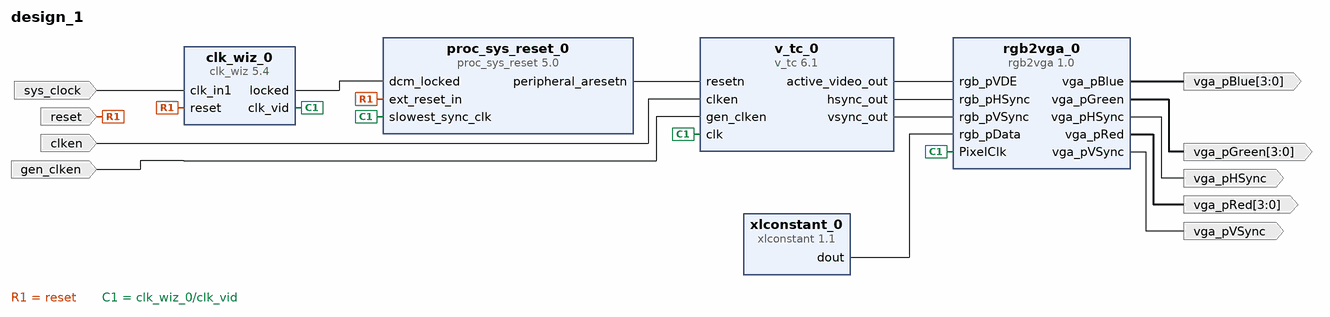
[diagram p0: block diagram of the top level]
# Vivado block design design_1, xc7a35tcpg236-1, Vivado 2017.4
create_bd_design design_1

create_bd_port -dir I -type clk sys_clock
set_property -dict {CONFIG.FREQ_HZ 100000000 CONFIG.PHASE 0.000} [get_bd_ports sys_clock]
create_bd_port -dir I -type rst reset
set_property -dict {CONFIG.POLARITY ACTIVE_HIGH} [get_bd_ports reset]
create_bd_port -dir O -from 3 -to 0 vga_pRed
create_bd_port -dir O -from 3 -to 0 vga_pGreen
create_bd_port -dir O -from 3 -to 0 vga_pBlue
create_bd_port -dir O vga_pHSync
create_bd_port -dir O vga_pVSync
create_bd_port -dir I -type ce clken
create_bd_port -dir I gen_clken

create_bd_cell -type ip -vlnv xilinx.com:ip:clk_wiz:5.4 clk_wiz_0
set_property -dict [list \
  CONFIG.CLKOUT2_USED true \
  CONFIG.NUM_OUT_CLKS 2 \
  CONFIG.CLK_OUT1_PORT clk_ap \
  CONFIG.CLK_OUT2_PORT clk_vid \
  CONFIG.CLKOUT1_REQUESTED_OUT_FREQ 450.000 \
  CONFIG.CLKOUT2_REQUESTED_OUT_FREQ 25.000 \
  CONFIG.MMCM_DIVCLK_DIVIDE 1 \
  CONFIG.MMCM_CLKFBOUT_MULT_F 9.000 \
  CONFIG.MMCM_CLKOUT0_DIVIDE_F 2.000 \
  CONFIG.MMCM_CLKOUT1_DIVIDE 36 \
  CONFIG.USE_BOARD_FLOW true \
  CONFIG.CLK_IN1_BOARD_INTERFACE sys_clock \
  CONFIG.RESET_BOARD_INTERFACE reset \
  CONFIG.CLKOUT1_JITTER 103.830 \
  CONFIG.CLKOUT1_PHASE_ERROR 105.461 \
  CONFIG.CLKOUT2_JITTER 183.467 \
  CONFIG.CLKOUT2_PHASE_ERROR 105.461 \
] [get_bd_cells clk_wiz_0]
create_bd_cell -type ip -vlnv xilinx.com:ip:proc_sys_reset:5.0 proc_sys_reset_0
set_property -dict {CONFIG.USE_BOARD_FLOW true CONFIG.RESET_BOARD_INTERFACE reset} [get_bd_cells proc_sys_reset_0]
create_bd_cell -type ip -vlnv digilentinc.com:ip:rgb2vga:1.0 rgb2vga_0
set_property -dict [list \
  CONFIG.kBlueDepth 4 \
  CONFIG.kGreenDepth 4 \
  CONFIG.kRedDepth 4 \
  CONFIG.VID_IN_DATA_WIDTH 12 \
] [get_bd_cells rgb2vga_0]
create_bd_cell -type ip -vlnv xilinx.com:ip:v_tc:6.1 v_tc_0
set_property -dict [list \
  CONFIG.HAS_AXI4_LITE false \
  CONFIG.VIDEO_MODE 640x480p \
  CONFIG.enable_detection false \
  CONFIG.vertical_blank_generation false \
  CONFIG.horizontal_blank_generation false \
] [get_bd_cells v_tc_0]
create_bd_cell -type ip -vlnv xilinx.com:ip:xlconstant:1.1 xlconstant_0
set_property -dict {CONFIG.CONST_WIDTH 12 CONFIG.CONST_VAL 1983} [get_bd_cells xlconstant_0]

# ---- connections ----

connect_bd_net [get_bd_ports sys_clock] [get_bd_pins clk_wiz_0/clk_in1]
connect_bd_net [get_bd_ports reset] [get_bd_pins clk_wiz_0/reset] [get_bd_pins proc_sys_reset_0/ext_reset_in]
connect_bd_net [get_bd_pins clk_wiz_0/clk_vid] \
  [get_bd_pins v_tc_0/clk] [get_bd_pins rgb2vga_0/PixelClk] [get_bd_pins proc_sys_reset_0/slowest_sync_clk]
connect_bd_net [get_bd_pins v_tc_0/active_video_out] [get_bd_pins rgb2vga_0/rgb_pVDE]
connect_bd_net [get_bd_pins v_tc_0/hsync_out] [get_bd_pins rgb2vga_0/rgb_pHSync]
connect_bd_net [get_bd_pins v_tc_0/vsync_out] [get_bd_pins rgb2vga_0/rgb_pVSync]
connect_bd_net [get_bd_pins clk_wiz_0/locked] [get_bd_pins proc_sys_reset_0/dcm_locked]
connect_bd_net [get_bd_pins proc_sys_reset_0/peripheral_aresetn] [get_bd_pins v_tc_0/resetn]
connect_bd_net [get_bd_pins xlconstant_0/dout] [get_bd_pins rgb2vga_0/rgb_pData]
connect_bd_net [get_bd_pins rgb2vga_0/vga_pRed] [get_bd_ports vga_pRed]
connect_bd_net [get_bd_pins rgb2vga_0/vga_pGreen] [get_bd_ports vga_pGreen]
connect_bd_net [get_bd_pins rgb2vga_0/vga_pBlue] [get_bd_ports vga_pBlue]
connect_bd_net [get_bd_pins rgb2vga_0/vga_pHSync] [get_bd_ports vga_pHSync]
connect_bd_net [get_bd_pins rgb2vga_0/vga_pVSync] [get_bd_ports vga_pVSync]
connect_bd_net [get_bd_ports clken] [get_bd_pins v_tc_0/clken]
connect_bd_net [get_bd_ports gen_clken] [get_bd_pins v_tc_0/gen_clken]

validate_bd_design
save_bd_design
